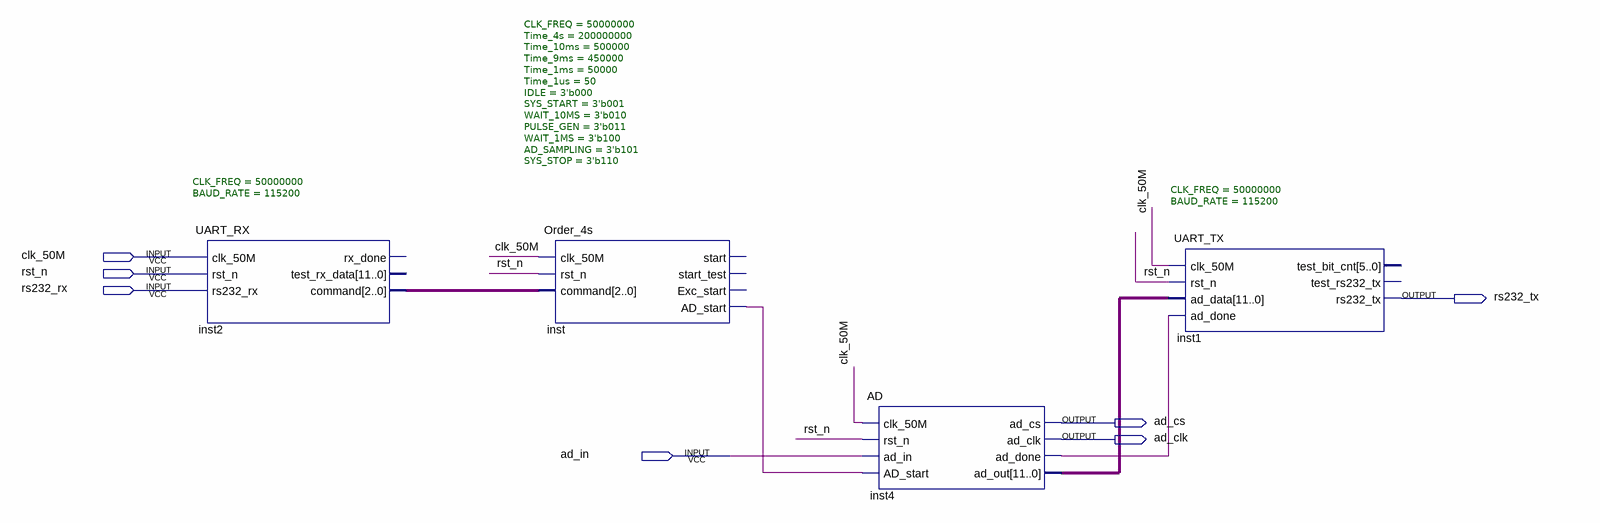
[diagram p0: schematic sheet]
// Quartus schematic tb_AD_UART.bdf as structural Verilog: 4 symbols, 7 pins
module tb_AD_UART (
  input  clk_50M,
  input  rst_n,
  input  rs232_rx,
  input  ad_in,
  output rs232_tx,
  output ad_cs,
  output ad_clk
);

  wire inst4_ad_done, inst_ad_start;
  wire [2:0] inst2_command;
  wire [11:0] inst4_ad_out;

  UART_RX #(.CLK_FREQ(50000000), .BAUD_RATE(115200)) inst2 (
    .clk_50M(clk_50M), .rst_n(rst_n), .rs232_rx(rs232_rx), .command(inst2_command));  // open: rx_done, test_rx_data
  Order_4s #(.CLK_FREQ(50000000), .Time_4s(200000000), .Time_10ms(500000), .Time_9ms(450000), .Time_1ms(50000), .Time_1us(50), .IDLE(3'b000), .SYS_START(3'b001), .WAIT_10MS(3'b010), .PULSE_GEN(3'b011), .WAIT_1MS(3'b100), .AD_SAMPLING(3'b101), .SYS_STOP(3'b110)) inst (
    .clk_50M(clk_50M), .rst_n(rst_n), .command(inst2_command), .AD_start(inst_ad_start));  // open: start, start_test, Exc_start
  AD inst4 (
    .clk_50M(clk_50M), .rst_n(rst_n), .ad_in(ad_in), .AD_start(inst_ad_start), .ad_cs(ad_cs),
    .ad_clk(ad_clk), .ad_done(inst4_ad_done), .ad_out(inst4_ad_out));
  UART_TX #(.CLK_FREQ(50000000), .BAUD_RATE(115200)) inst1 (
    .clk_50M(clk_50M), .rst_n(rst_n), .ad_data(inst4_ad_out), .ad_done(inst4_ad_done), .rs232_tx(rs232_tx));  // open: test_bit_cnt, test_rs232_tx
endmodule
